# EAGLE design Adafruit ICM20948 (EAGLE 9.6.2)
COMPANY: ADAFRUIT INDUSTRIES; DRAWN: KTOWN; REV: A
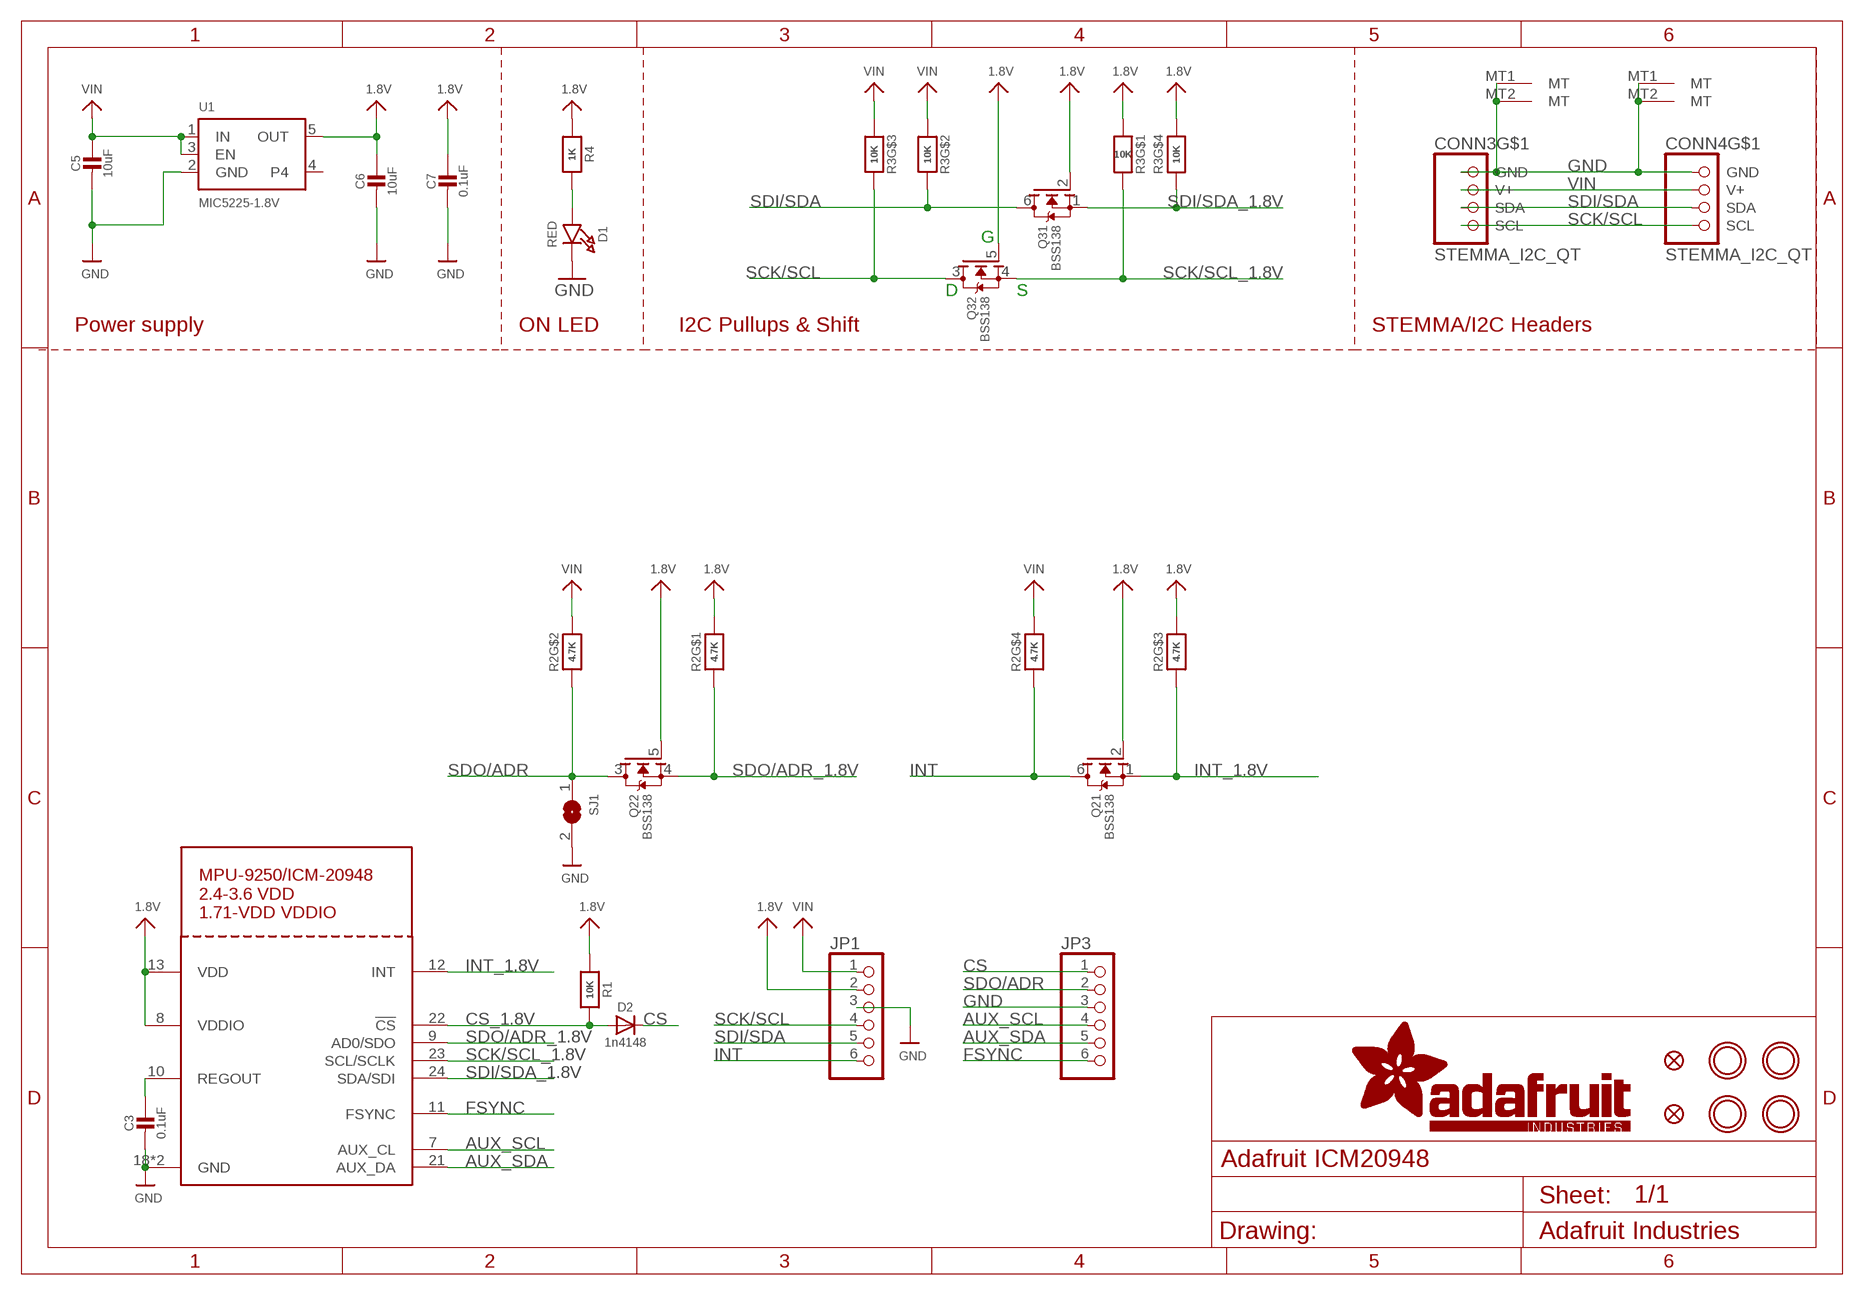
[diagram p0: schematic, sheet 1]

## Parts
C3  0.1uF  CAP_CERAMIC0603_NO  [0603-NO]
C5  10uF  CAP_CERAMIC0805-NOOUTLINE  [0805-NO]
C6  10uF  CAP_CERAMIC0805-NOOUTLINE  [0805-NO]
C7  0.1uF  CAP_CERAMIC0603_NO  [0603-NO]
CONN3  STEMMA_I2C_QT  [JST_SH4]
CONN4  STEMMA_I2C_QT  [JST_SH4]
D1  RED  LED0603_NOOUTLINE  [CHIPLED_0603_NOOUTLINE]
D2  1n4148  DIODE_SOD323MINI  [SOD-323_MINI]
FID2  FIDUCIAL_1MM  [FIDUCIAL_1MM]
FID4  FIDUCIAL_1MM  [FIDUCIAL_1MM]
JP1  HEADER-1X670MIL  [1X06_ROUND_70]
JP3  HEADER-1X670MIL  [1X06_ROUND_70]
Q2  BSS138  MOSFET-N_DUAL  [SOT363]
Q3  BSS138  MOSFET-N_DUAL  [SOT363]
R1  10K  RESISTOR_0603_NOOUT  [0603-NO]
R2  4.7K  RESISTOR_4PACK  [RESPACK_4X0603]
R3  10K  RESISTOR_4PACK  [RESPACK_4X0603]
R4  1K  RESISTOR_0603_NOOUT  [0603-NO]
SJ1  SOLDERJUMPER  [SOLDERJUMPER_ARROW_NOPASTE]
U1  MIC5225-1.8V  VREG_SOT23-5  [SOT23-5]
U$21  MPU-9250_ICM20948  [QFN24_3MM_NOEP]
U$38  MOUNTINGHOLE2.5  [MOUNTINGHOLE_2.5_PLATED]
U$39  MOUNTINGHOLE2.5  [MOUNTINGHOLE_2.5_PLATED]
U$41  MOUNTINGHOLE2.5  [MOUNTINGHOLE_2.5_PLATED]
U$42  MOUNTINGHOLE2.5  [MOUNTINGHOLE_2.5_PLATED]

## Nets
1.8V: C6.1 C7.1 JP1.2 Q2.2(1:G) Q2.5(2:G) Q3.2(1:G) Q3.5(2:G) R1.1 R2.6 R2.8 R3.4 R3.8 R4.1 U1.5(OUT) U$21.8(VDDIO) U$21.13(VDD)
AUX_SCL: JP3.4 U$21.7(AUX_CL)
AUX_SDA: JP3.5 U$21.21(AUX_DA)
CS: D2.C JP3.1
CS_1.8V: D2.A R1.2 U$21.22(!CS)
FSYNC: JP3.6 U$21.11(FSYNC)
GND: C3.2 C5.2 C6.2 C7.2 CONN3.1(GND) CONN3.MT1(MT) CONN3.MT2(MT) CONN4.1(GND) CONN4.MT1(MT) CONN4.MT2(MT) D1.C JP1.3 JP3.3 SJ1.2 U1.2(GND) U$21.18(GND) U$21.20(GND)
INT: JP1.6 Q2.6(1:D) R2.4
INT_1.8V: Q2.1(1:S) R2.3 U$21.12(INT)
N$1: D1.A R4.2
REGOUT: C3.1 U$21.10(REGOUT)
SCK/SCL: CONN3.4(SCL) CONN4.4(SCL) JP1.4 Q3.3(2:D) R3.6
SCK/SCL_1.8V: Q3.4(2:S) R3.1 U$21.23(SCL/SCLK)
SDI/SDA: CONN3.3(SDA) CONN4.3(SDA) JP1.5 Q3.6(1:D) R3.7
SDI/SDA_1.8V: Q3.1(1:S) R3.5 U$21.24(SDA/SDI)
SDO/ADR: JP3.2 Q2.3(2:D) R2.2 SJ1.1
SDO/ADR_1.8V: Q2.4(2:S) R2.1 U$21.9(AD0/SDO)
VIN: C5.1 CONN3.2(V+) CONN4.2(V+) JP1.1 R2.5 R2.7 R3.2 R3.3 U1.1(IN) U1.3(EN)
Unconnected: U1.4

## Notes on the sheet
- G
- D | S
- Power supply | ON LED | I2C Pullups & Shift | STEMMA/I2C Headers

## Library data of the parts
C3 C5-C7 = microbuilder:CAP_CERAMIC: Ceramic Capacitors For new designs, use the packages preceded by an '_' character since they are more reliable: The following footprints should be used on most boards: _0402 - Standard footprint for regular board layouts _0603 - Standard footprint for regular board layouts _0805 - Standard footprint for regular board layouts _1206 - Standard footprint for regular board layouts For extremely tight-pitch boards where space is at a premium, the following 'micro-pitch' footprints can be used (smaller pads, no silkscreen outline, etc.): _0402MP - Micro-pitch footprint for very dense/compact boards _0603MP - Micro-pitch footprint for very dense/compact boards _0805MP - Micro-pitch footprint for very dense/compact boards _1206MP - Micro-pitch footprint for very dense/compact boards
CONN3 CONN4 = microbuilder:STEMMA_I2C
D1 = microbuilder:LED: LED 0603 - 0603 Surface Mount Package 2mA: Green LED - Low Power (3.9mcd, 2ma, 1.7Vf) - Digikey: 475-2709-2-ND Orange LED - Low Power (9.8mcd, 2ma, 1.8Vf) - Digikey: 475-1194-2-ND Red LED - Low Power (5mcd, 2ma, 1.8Vf) - Digikey: 475-1195-2-ND Yellow LED - Low Power (7mcd, 2ma, 1.8Vf) - Digikey: 475-1196-2-ND 5mA: Blue LED - Low Power (17mcd, 5ma, 2.9Vf) - Digikey: LNJ937W8CRACT-ND 0805 - 0805 Surface Mount Package 2mA: Red LED (8.8mcd, 2mA, 1.8Vf, Clear) - Low Power [Digikey: 475-2510-1-ND] Green LED (5mcd, 2mA, 1.8Vf, Clear) - Low Power [Digikey: 475-2730-1-ND] Yellow LED (11.3mcd, 2mA, 1.8Vf, Clear) - Low Power [Digikey: 475-2555-1-ND] 20mA: Red LED (104mcd, 20mA, Diffused) - LS R976 [Digikey: 475-1278-6-ND] Red LED (12mcd, 20mA, 2.0Vf, Clear) - APT2012EC [Digikey: 754-1128-1-ND] Green LED (15mcd, 20mA, 2.2Vf, Clear) - APT2012GC [Digikey: 754-1131-1-ND] Orange LED (160mcd, 20mA, 2.1Vf, Clear) - APT2012SECK [Digikey: 754-1130-1-ND] 1206 - 1206 Surface Mount Package Green LED (26mcd, 20mA, Diffused) - LG N971 [Digikey: 475-1407-6-ND] Red LED (15mcd, 20mA, Diffused) - LH N974 [Digikey: 475-1416-6-ND] Cree - Cree High-Power Surface Mount LEDs XPEBWT-L1-0000-00D50 - White 111lm 350mA 2.9Vf 6200K 110° XTEAWT-00-0000-00000LEE3 - White 114lm 350mA 2.85Vf 5000K 115° Everlight - Everlight 45-21 Series Surface Mount LEDs 45-21/QK2C-B2832AC2CB2/2T - Warm White 2000mcd 20mA 3.25Vf 3050K 120° 45-21/LK2C-B38452C4CB2/2T - Nuetral White 2000mcd 20mA 3.25Vf 4150K 120° 45-21/LK2C-B50634C6CB2/2T - Cold White 2200mcd 20mA 3.25Vf 5650K 120° PLCC2 Reverse Mount LS T77K-J1L2-1-0-2-R18-Z - Red 11.25mcd 2mA 1.8Vf 630nm 120° LO T77K-L1M2-24-Z - Orange 19.6mcd 2mA 1.8Vf 606nm 120° LY T77K-K2M1-26-Z - Yellow 15.7mcd 2mA 1.8Vf 587nm 120°
D2 = microbuilder:DIODE: Diode SMA Model Volts Amps Type Vf Ir Digikey # Notes SSA34-E3 40V 3A Schottky 480mV @ 3A 200uA @ 40V SSA34-E3/61TGITR-ND CDBA120-G 20V 1A Schottky 500mV @ 1A 500uA @ 20V 641-1014-6-ND REEL MBRA210 10V 2A Schottky 350mV @ 2A 700uA @ 10V MBRA210LT3 SOD-123 Model Volts Amps Type Vf Ir Order # Notes BAT54T1G 30V 200mA Schottky 800mV @ 200mA 2uA @ 25V BAT54T1GOSTR-ND B0530W 30V 500mA Schottky 430mV @ 500mA 130uA @ 30V B0530W-FDICT-ND REEL MBR120 20V 1A Schottky 340mV @ 1A MBR120VLSFT1GOSCT-ND SOD-323 Model Volts Amps Type Vf Ir Order # Notes PMEG2005EJ 20V 500mA Schottky 355mV @ 500mA 568-4110-1-ND ZLLS410 10V 570mA Schottky 380mV @ 570mA ZLLS410CT-ND 1N4148WS 75V 150mA Silicon/Simple 1V 1N4148WSFSCT-ND REEL SOD-523 Model Volts Amps Type Vf Ir Order # Notes BAT54XV2 30V 200mA Schottky 0.8V @ 100mA BAT54XV2CT-ND TB751S 30V 30mA Schottky RB751S-40TE61CT-ND SOT23-R/W (R = Solder Paste/Reflow Ovens, W = Hand-Soldering) Model Volts Amps Type Vf Ir Order # Notes BAT54FILM 40V 300mA Schottky 497-7162-1-ND POWERDI-5 Model Volts Amps Type Vf Ir Order # Notes PDS560 60V 5A Schottky 670mV @ 5A 150uA @ 60V PDS560DICT-ND
FID2 FID4 = microbuilder:FIDUCIAL: Fiducial Alignment Points Various fiducial points for machine vision alignment.; BOM: EXCLUDE
JP1 JP3 = microbuilder:HEADER-1X6: PIN HEADER
Q2 Q3 = microbuilder:MOSFET-N_DUAL: Dual N-Channel MOSFET SOT363 (2.0x1.25mm) 2N7002PS - 60V, 320mA [Digikey: 568-5984-1-ND]
R1 R4 = microbuilder:RESISTOR: Resistors For new designs, use the packages preceded by an '_' character since they are more reliable: The following footprints should be used on most boards: _0402 - Standard footprint for regular board layouts _0603 - Standard footprint for regular board layouts _0805 - Standard footprint for regular board layouts _1206 - Standard footprint for regular board layouts For extremely tight-pitch boards where space is at a premium, the following 'micro-pitch' footprints can be used (smaller pads, no silkscreen outline, etc.): _0402MP - Micro-pitch footprint for very dense/compact boards _0603MP - Micro-pitch footprint for very dense/compact boards _0805MP - Micro-pitch footprint for very dense/compact boards _1206MP - Micro-pitch footprint for very dense/compact boards
R2 R3 = microbuilder:RESISTOR_4PACK: Resistor Packs (4 resistors) 4 x 0603 10K 1/16W - Digikey: YC164J-10KCT-ND
SJ1 = microbuilder:SOLDERJUMPER: SMD Solder JUMPER Solder the two pads together to create a connection, or remove the solder to break it. REFLOW - Use this footprint for solder paste and reflow ovens. WAVE - Use this footprint for hand-soldering (larger pads). CLOSED - Has a trace between the two pads to ensure it is closed by default. The trace needs to be cut to disable the jumper, and can be closed again by creating a solder bridge between the two pads.; BOM: EXCLUDE
U1 = microbuilder:VREG_SOT23-5: SOT23-5 Fixed Voltage Regulators Part Current Out V Out V In V Dropout θJA (°C/W) TJ (°C) Digikey Part No. ADP121 150mA 3.3V 3.4-5.5V 0.09V @ 150mA -- -- ADP121-AUJZ33R7CT-ND ADP121 150mA 3.0V 3.1-5.5V 0.09V @ 150mA -- -- ADP121-AUJZ30R7CT-ND ADP122 300mA 3.3V 3.4-5.5V 0.085V @ 300mA -- -- ADP122AUJZ-3.3-R7CT-ND ADP1712 300mA 3.3V 3.5-5.5V 0.17V @ 300mA -- -- ADP1712AUJZ-3.3-R7TR-ND AP7311 (Low Cost) 150mA 3.3V 3.5-6V 0.15V @ 150mA -- -- AP7311-33WG-7DICT-ND LD39015M18R 150mA 1.8V 1.9V-5.5V 0.08V @ 100mA -- -- 497-6977-1-ND LP2985A-33DBVR 150mA 3.3V 3.3-16V 0.28V @ 150mA 206 150 296-18479-1-ND MCP1824T-3302E/OT 300mA 3.3V 3.5V-6V 0.2V @ 300mA -- -- MCP1824T-3302E/OTCT-ND MIC5205-2.5YM5 TR 150mA 2.5V 2.7-16V 0.165V @ 150mA -- -- 576-1257-2-ND MIC5205-3.0YM5 TR 150mA 3.0V 3.2V-16V 0.165V @ 150mA -- -- 576-1258-2-ND MIC5205-3.3YM5 TR 150mA 3.3V 3.5V-16V 0.165V @ 150mA -- -- 576-1259-2-ND TPS780330220 150mA 3.3V+2.2V 3.6-5.5V 250mV Max -- -- 296-23332-1-ND TDA3663/N1,135 100mA 3.3V 3.5-45V 0.18V @ 50mA -- -- 568-5343-1-ND Max operating temp can be calculated using θJA, TJ (max junction temperature), and power in watts. Set the "Maximum Ambient Temperature" until it reaches TJ ("Max Junction Temperature"), which is the absolute limit for safe use of the regulator: Heat Sink Temperature Calculator <http://www.daycounter.com/Calculators/Heat-Sink-Temperature-Calculator.phtml> For example, With 12V source into a 3.3V LP2985 and a 30mA load, we are dissipating (12V-3.3V) * 0.03A = 0.261W. With a θJA of 206 °C/W, a TJ of 150°C, and 261mW we can safely use the chip without a heat sink up to 75°C (=147.1°C Junction Temperature).
U$21 = adafruit_sensor:MPU-9250: MPU-9250 3-Axis gyroscope and 3-Axis accelerometer
U$38 U$39 U$41 U$42 = microbuilder:MOUNTINGHOLE: Mounting Hole For #2 screws (0.086"/2.18mm width, 0.094"/2.4mm hole) use 2.5mm; BOM: EXCLUDE

## Net classes
1 highpower: width 0.406 mm, drill 0.483 mm
2 lowpower: width 0.305 mm, drill 0.483 mm

## Board
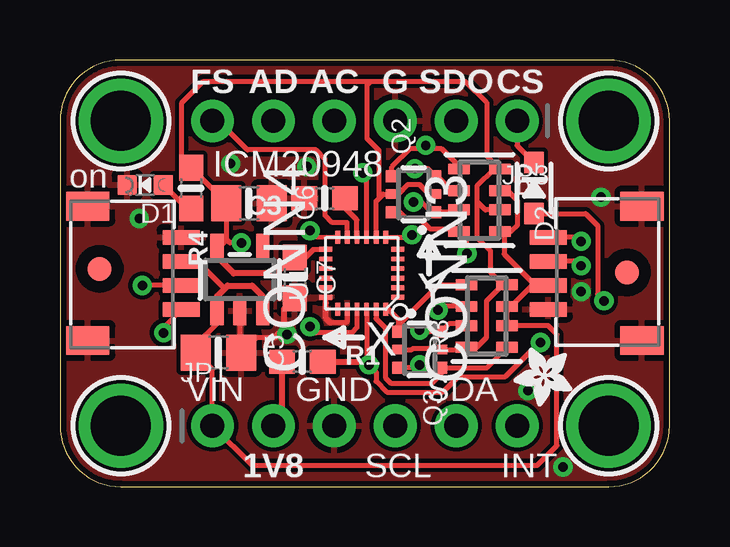
[diagram p1: board, top side]
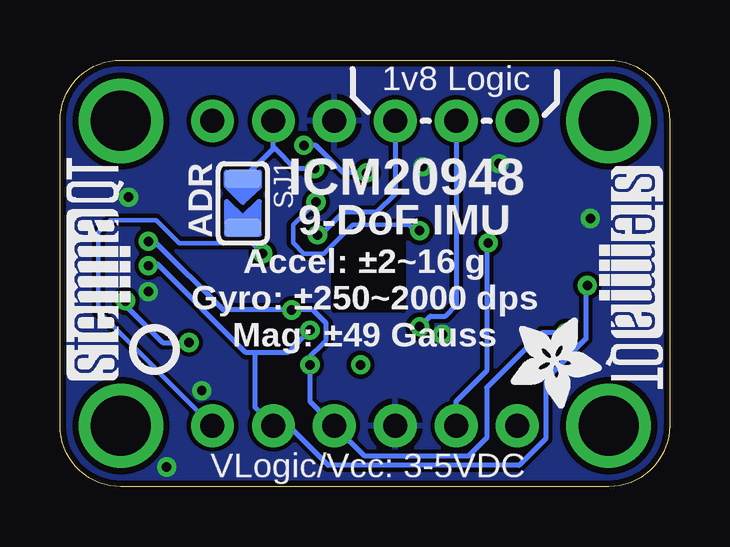
[diagram p2: board, bottom side, seen from below]

Size 25.4 x 17.78 mm. Coordinates in mm from the lower left corner, seen from the top.
Outline: 0,15.24 0,2.54 arc90 2.54,0 22.86,0 arc90 25.4,2.54 25.4,15.24 arc90 22.86,17.78 2.54,17.78 arc90 0,15.24
Copper layers (1*16): Top 0.035mm / dielectric 1.5mm / Bottom 0.035mm
Design rules "adafruit *": minimum track width 7mil, minimum drill 15.5mil, track to track 7mil, track to pad 7mil, pad to pad 7mil, via to via 7mil, smd to smd 7mil, copper to edge 10mil, drill to drill 8mil, minimum pad ring 10mil, minimum via ring 8mil, stop-mask expansion 2mil, vias tented up to drill 20mil, thermal gap 10mil
tRestrict: area 11.6,7.9 to 13.5,9.9
bRestrict: area 11.1,7.4 to 14,10.4

### Footprints (pad centres in the part's own frame; a part is rotated, then mirrored left to right if it is on the bottom)
0603-NO = smd 1.075 x 1: 1 -0.85,0; 2 0.85,0
0805-NO = smd 1.24 x 1.5: 1 -0.95,0; 2 0.95,0
JST_SH4 = smd 0.6 x 1.55: 1 -1.5,2.514; 2 -0.5,2.514; 3 0.5,2.514; 4 1.5,2.514 | smd 1.2 x 1.8: MT1 -2.8,-1.386; MT2 2.8,-1.386
CHIPLED_0603_NOOUTLINE = smd 0.8 x 0.8: A 0,-0.75; C 0,0.75
SOD-323_MINI = smd 0.9 x 0.8: A 1.07,0; C -1.07,0
FIDUCIAL_1MM = smd 1 x 1: 1 0,0
1X06_ROUND_70 = drill 1 pad 1.778: 1 -6.35,0; 2 -3.81,0; 3 -1.27,0; 4 1.27,0; 5 3.81,0; 6 6.35,0
SOT363 = smd 0.5 x 0.5: 1 -0.75,-0.9; 3 0.75,-0.9; 4 0.75,0.9; 6 -0.75,0.9 | smd 0.4 x 0.5: 2 0,-0.9; 5 0,0.9
RESPACK_4X0603 = smd 0.45 x 0.9: 1 -1.3,-0.85; 2 -0.4,-0.85; 3 0.4,-0.85; 4 1.3,-0.85; 5 1.3,0.85; 6 0.4,0.85; 7 -0.4,0.85; 8 -1.3,0.85
SOLDERJUMPER_ARROW_NOPASTE = smd 0.762 x 1.524: 1 -1.016,0; 2 1.016,0
SOT23-5 = smd 0.55 x 1.2: 1 -0.95,-1.3; 2 0,-1.3; 3 0.95,-1.3; 4 0.95,1.3; 5 -0.95,1.3
QFN24_3MM_NOEP = smd 0.55 x 0.2: 1 -1.5,1; 2 -1.5,0.6; 3 -1.5,0.2; 4 -1.5,-0.2; 5 -1.5,-0.6; 6 -1.5,-1; 13 1.5,-1; 14 1.5,-0.6; 15 1.5,-0.2; 16 1.5,0.2; 17 1.5,0.6; 18 1.5,1 | smd 0.2 x 0.55: 7 -1,-1.5; 8 -0.6,-1.5; 9 -0.2,-1.5; 10 0.2,-1.5; 11 0.6,-1.5; 12 1,-1.5; 19 1,1.5; 20 0.6,1.5; 21 0.2,1.5; 22 -0.2,1.5; 23 -0.6,1.5; 24 -1,1.5
MOUNTINGHOLE_2.5_PLATED = drill 2.5 pad 3.2: P$1 0,0

### Placement (x,y rotation side)
C3  11.02,12.01 180 top
C5  6.6,5.59 0 top
C6  7.87,11.81 0 top
C7  9.78,8.7 270 top
CONN3  22.86,8.89 90 top
CONN4  2.54,8.89 270 top
D1  3.56,12.57 90 top
D2  19.75,12.45 270 top
FID2  1.65,9.08 0 top
FID4  23.62,8.93 0 top
JP1  12.7,2.54 0 top
JP3  12.7,15.24 180 top
Q2  14.73,12.19 90 top
Q3  14.99,5.71 270 top
R1  10.1,5.21 0 top
R2  17.48,11.94 270 top
R3  17.78,7.11 90 top
R4  5.46,12.45 270 top
SJ1  17.78,11.81 270 bottom
U1  7.49,8.64 0 top
U$2  [ADAFRUIT_2.5MM]  21.34,5.78 180 top
U$12  [ADAFRUIT_3.5MM]  6.63,7.06 270 bottom
U$21  12.57,8.89 180 top
U$38  2.54,15.24 0 top
U$39  22.86,15.24 0 top
U$41  2.54,2.54 0 top
U$42  22.86,2.54 0 top
U$45  [PCBFEAT-REV-040]  21.46,5.71 0 bottom
U$46  [STEMMAQT]  22.48,4.45 90 bottom
U$47  [STEMMAQT]  2.92,13.34 270 bottom

### Tracks (layer width: path | path; a pad name or v marks a point on that pad's centre or on a via)
1.8V  (via drill 0.39)
  Top 0.203: 18.45,8.41 R3.4 | 18.45,8.41 17.78,7.75 17.78,6.22 17.37,5.81 R3.8 16.61,5.81 16.51,5.71 Q3.5 15.44,5.71 15.39,5.76 14.71,5.76 14.66,5.71 Q3.2 | U$21.8 13.17,11.9 13.3,12.03 | 13.3,12.03 13.46,12.19 Q2.5 14.09,12.19 14.47,12.57 15,12.57 15.38,12.19 Q2.2 | 18.45,8.41 17.94,8.92 17.94,9.81 17.39,10.36 17.39,11.87 | C7.1 10.22,9.55 10.56,9.89 U$21.13 | 6.92,10.31 7.07,10.16 v7.56,10.16 | 6.92,10.31 6.92,10.29 | 6.92,10.31 C6.1 6.92,11.83 R4.1 5.08,13.68 5.08,16 5.97,16.89 12.95,16.89 | 12.95,16.89 16.89,16.89 17.77,16.01 17.77,13.79 R2.8 18.06,13.24 17.39,12.57 17.39,11.87 | 13.3,12.03 13.3,14.01 12.8,14.5 12.8,16.74 12.95,16.89 | R2.6 17.73,11.54 17.39,11.87
  Top 0.254: 6.92,10.29 6.57,9.94 U1.5 6.54,9.59 7.24,8.89 9.02,8.89 9.68,9.55 C7.1 | R1.1 9.25,2.9 JP1.2
  Bottom 0.203: JP1.2 8.89,3.56 7.62,4.83 7.62,10.1 v7.56,10.16
AUX_SCL  (via drill 0.39)
  Top 0.203: U$21.7 14.67,10.39 v14.67,10.5
  Bottom 0.203: v14.67,10.5 14.54,10.5 13.61,11.43 12.19,11.43 11.43,12.19 JP3.4
AUX_SDA  (via drill 0.39)
  Top 0.203: U$21.21 12.37,6.64 12.15,6.41 10.67,6.41 v10.41,6.67
  Bottom 0.203: JP3.5 8.89,7.56 9.33,7.11 9.97,7.11 v10.41,6.67
CS
  Top 0.203: JP3.1 19.05,14.21 D2.C
CS_1.8V  (via drill 0.39)
  Top 0.203: U$21.22 12.77,5.18 v12.88,5.08 13.17,4.78 13.17,4.39 13.62,3.94 15.94,3.94 16.59,4.58 18.55,4.58 19.98,6 v20.02,6 | D2.A 21.9,11.38 22.4,10.88 22.4,8.02 v22.67,7.75
  Top 0.254: R1.2 12.75,5.21 v12.88,5.08
  Bottom 0.203: v22.67,7.75 22.77,7.65 21.12,6 v20.02,6
FSYNC
  Top 0.203: JP3.6 6.6,15.24 7.81,14.03 10.67,14.03 11.05,13.65 11.05,11.3 11.35,11.01 11.95,11.01 11.95,11 11.95,10.41 U$21.11
GND  (via drill 0.39)
  Top 0.203: U1.2 7.49,5.65 C5.2 8.19,6.22 8.95,6.22 | 11.07,7.65 U$21.18 | U$21.20 11.97,6.89 11.91,6.83 11.26,6.83
  Top 0.254: 8.95,6.22 9.34,6.6 9.34,7.41 C7.2 | 11.26,6.83 11.07,7.02 11.07,7.65
  other vias: 3.3,11.18 7.11,13.46 10.29,13.34 9.46,6.35 22.54,12.06 21.72,8.13 20.95,0.83 19.49,4
  pour Top: 0,17.78 25.4,17.78 25.4,0 0,0
  pour Bottom: 0,17.78 25.4,17.78 25.4,0 0,0
INT  (via drill 0.39)
  Top 0.178: R2.4 16.95,10.31 v16.95,9.72
  Top 0.203: Q2.6 14.15,11.44 14.4,11.19 14.97,11.19 15.43,10.73 16.53,10.73 R2.4
  Bottom 0.178: v16.95,9.72 17.39,10.15 20.43,10.15 21.39,11.11 23.3,11.11 23.81,10.6 23.81,7.3 JP1.6
INT_1.8V  (via drill 0.39)
  Top 0.178: U$21.12 10.69,10.39 v10.41,10.67 | Q2.1 15.47,11.44 15.05,11.87 v14.73,11.87
  Top 0.203: R2.3 16.53,11.44 Q2.1
  Bottom 0.178: v10.41,10.67 10.6,10.67 10.86,10.92 13.21,10.92 14.41,9.72 15.24,9.72 15.68,10.16 15.68,10.91 v14.73,11.87
N$1
  Top 0.203: D1.A 5.28,11.6 R4.2
REGOUT
  Top 0.203: U$21.10 12.37,11.12 11.87,11.62 C3.1
SCK/SCL  (via drill 0.39)
  Top 0.203: v21.72,10.22 21.55,10.39 CONN3.4 | R3.6 15.89,7.51 v15.75,7.37 | CONN4.4 4.32,6.65 v4.32,6.41 | v14.99,5.08 15.08,4.99 15.06,4.96 Q3.3
  Bottom 0.203: v21.72,10.22 21.46,10.22 18.61,7.37 v15.75,7.37 14.86,7.37 14.31,6.81 14.31,6.11 15.11,5.31 15.11,5.08 v14.99,5.08 14.99,3.56 JP1.4 12.7,1.27 8.38,1.27 7.62,2.03 7.62,4.13 5.33,6.41 v4.32,6.41
SCK/SCL_1.8V
  Top 0.203: U$21.23 13.17,7.01 13.55,6.63 13.55,4.54 13.78,4.32 15.49,4.32 15.89,4.71 Q3.4 17.79,4.96 R3.1
SDI/SDA  (via drill 0.39)
  Top 0.203: R3.7 16.86,6.78 16.2,6.78 Q3.6 15.04,6.46 v14.99,6.52 | v21.72,9.21 21.54,9.39 CONN3.3 | v3.43,8.38 v3.44,8.39 CONN4.3
  Bottom 0.203: v14.99,6.52 15.92,5.59 17.27,5.59 | v21.72,9.21 21.65,9.27 21.34,9.27 17.65,5.59 17.27,5.59 | 17.27,5.59 17.27,3.3 JP1.5 15.88,2.54 14.22,0.89 6.27,0.89 5.17,1.99 5.17,4.48 3.49,6.16 3.49,8.32 v3.43,8.38
SDI/SDA_1.8V
  Top 0.203: U$21.24 13.67,7.39 14.09,6.97 14.09,6.72 | 14.09,6.72 15.78,8.41 R3.5 | Q3.1 14.09,6.72
SDO/ADR  (via drill 0.39)
  Top 0.203: v14.79,13.25 15.32,13.25 Q2.3 15.65,12.93 15.74,12.93 16.33,12.34 R2.2
  Bottom 0.203: 16.48,14.12 16.51,14.15 JP3.2 | 16.48,14.12 15.61,13.25 v14.79,13.25 | SJ1.1 16.48,14.12
SDO/ADR_1.8V  (via drill 0.39)
  Top 0.203: Q2.4 13.83,13.32 14.61,14.1 15.24,14.1 | 15.24,14.1 15.88,14.1 16.62,13.35 R2.1 | U$21.9 12.77,12.86 12.62,13.01 v12.62,13.08 | v15.24,14.22 15.24,14.1
  Bottom 0.203: v12.62,13.08 13.59,13.08 14.73,14.22 v15.24,14.22
VIN
  Top 0.203: U1.1 6.54,6.79 5.65,5.91 C5.1 6.35,4.89 JP1.1 8,0.89 19.88,0.89 20.7,1.71 20.7,6.35 20.34,6.71 R3.2 R3.3 18.8,7.51 19.68,8.39 19.8,8.39 | CONN4.2 5.72,9.39 6.86,8.26 | R2.7 18.65,12.34 19.06,11.93 19.06,10.9 18.8,10.64 R2.5 18.5,10.46 18.5,9.69 19.8,8.39 | 19.8,8.39 CONN3.2
  Top 0.254: U1.1 6.54,7.94 6.86,8.26 6.99,8.38 8,8.38 8.44,7.94 U1.3

### Text on the board
tPlace: FS | AD | AC | G | SDO | CS | ICM20948 | on | Y | X | VIN | GND | SDA | 1V8 | SCL | INT
bPlace: 1v8 Logic | ICM20948 | ADR | 9-DoF IMU | Accel: ±2~16 g / Gyro: ±250~2000 dps / Mag: ±49 Gauss | VLogic/Vcc: 3-5VDC